# Altium schematic sheet lm3886 Audio Amplifier.SchDoc
size A4
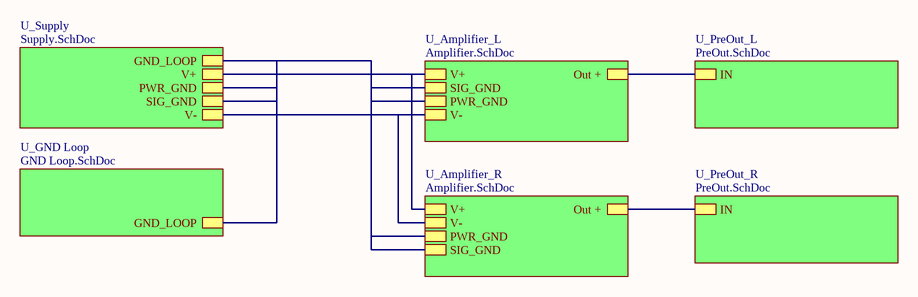
[diagram p0: lm3886 Audio Amplifier.SchDoc]

## Sub-sheets
U_Amplifier_L = Amplifier.SchDoc: V+, V-, PWR_GND, SIG_GND, Out +
U_Amplifier_R = Amplifier.SchDoc: V+, V-, PWR_GND, SIG_GND, Out +
U_GND Loop = GND Loop.SchDoc: GND_LOOP
U_PreOut_L = PreOut.SchDoc: IN
U_PreOut_R = PreOut.SchDoc: IN
U_Supply = Supply.SchDoc: V+, V-, PWR_GND, SIG_GND, GND_LOOP